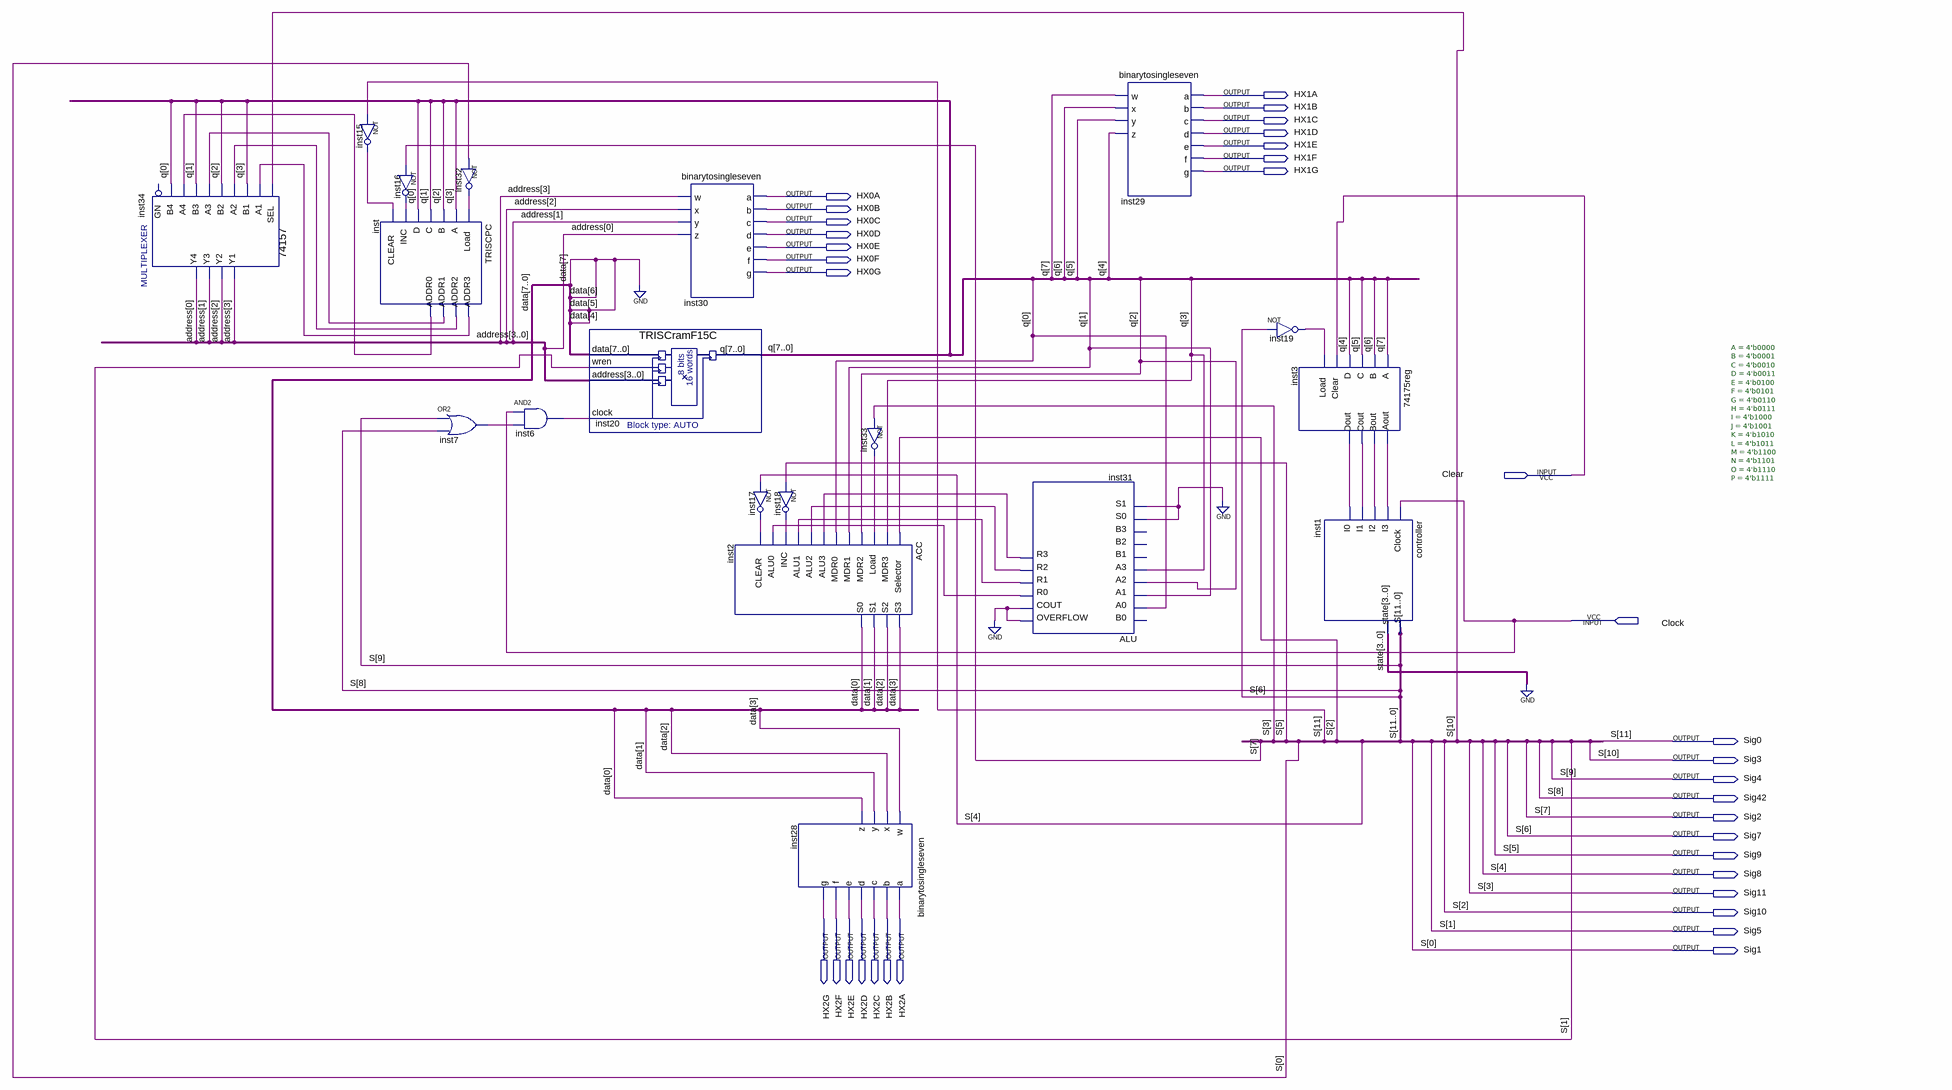
[diagram p0: schematic sheet]
// Quartus schematic TRISCC.bdf as structural Verilog: 19 symbols, 35 pins
module TRISCC (
  input  Clear,
  input  Clock,
  output HX1A,
  output HX1B,
  output HX1C,
  output HX1D,
  output HX1E,
  output HX1F,
  output HX1G,
  output HX0A,
  output HX0B,
  output HX0C,
  output HX0D,
  output HX0E,
  output HX0F,
  output HX0G,
  output Sig0,
  output Sig3,
  output Sig4,
  output Sig42,
  output Sig2,
  output Sig7,
  output Sig9,
  output Sig8,
  output Sig11,
  output Sig10,
  output HX2G,
  output HX2F,
  output HX2E,
  output HX2D,
  output HX2C,
  output HX2B,
  output HX2A,
  output Sig5,
  output Sig1
);

  wire inst3_aout, inst3_bout, inst3_cout, inst3_dout, inst6_out, inst7_out, inst15_out, inst16_out,
       inst17_out, inst18_out, inst19_out, inst31_overflow, inst31_r0, inst31_r1, inst31_r2, inst31_r3,
       inst32_out, inst33_out, inst_addr0, inst_addr1, inst_addr2, inst_addr3;
  wire [3:0] address, data, state;
  wire [7:0] q;

  \74157  inst34 (
    .A1(inst_addr3), .B1(q[3]), .SEL(Sig3), .B2(q[2]), .A3(inst_addr1), .B3(q[1]), .A2(inst_addr2),
    .B4(q[0]), .A4(inst_addr0), .Y2(address[2]), .Y1(address[3]), .Y4(address[0]), .Y3(address[1]));  // open: GN
  not inst15 (inst15_out, Sig0);
  TRISCPC inst (
    .Load(inst32_out), .A(q[3]), .B(q[2]), .C(q[1]), .D(q[0]), .INC(inst16_out), .CLEAR(inst15_out),
    .ADDR3(inst_addr3), .ADDR2(inst_addr2), .ADDR1(inst_addr1), .ADDR0(inst_addr0));
  not inst16 (inst16_out, Sig2);
  or inst7 (inst7_out, Sig4, Sig42);
  not inst32 (inst32_out, Sig1);
  and inst6 (inst6_out, Clock, inst7_out);
  TRISCramF15C inst20 (.data({4'b0000, data}), .wren(Sig5), .address(address), .clock(inst6_out), .q(q));
  binarytosingleseven inst30 (
    .w(address[3]), .x(address[2]), .y(address[1]), .z(address[0]), .a(HX0A), .b(HX0B), .c(HX0C), .d(HX0D),
    .e(HX0E), .f(HX0F), .g(HX0G));
  ACC inst2 (
    .Selector(Sig10), .MDR3(q[3]), .Load(inst33_out), .MDR2(q[2]), .MDR1(q[1]), .MDR0(q[0]),
    .ALU3(inst31_r3), .ALU2(inst31_r2), .ALU1(inst31_r1), .INC(inst18_out), .ALU0(inst31_r0),
    .CLEAR(inst17_out), .S3(data[3]), .S2(data[2]), .S1(data[1]), .S0(data[0]));
  not inst17 (inst17_out, Sig8);
  not inst18 (inst18_out, Sig9);
  binarytosingleseven inst28 (
    .w(data[3]), .x(data[2]), .y(data[1]), .z(data[0]), .a(HX2A), .b(HX2B), .c(HX2C), .d(HX2D), .e(HX2E),
    .f(HX2F), .g(HX2G));
  not inst33 (inst33_out, Sig11);
  ALU inst31 (
    .A0(q[0]), .A1(q[1]), .A2(q[2]), .A3(q[3]), .S0(1'b0), .S1(1'b0), .OVERFLOW(inst31_overflow),
    .COUT(inst31_overflow), .R0(inst31_r0), .R1(inst31_r1), .R2(inst31_r2), .R3(inst31_r3));  // open: B0, B1, B2, B3
  binarytosingleseven inst29 (
    .w(q[7]), .x(q[6]), .y(q[5]), .z(q[4]), .a(HX1A), .b(HX1B), .c(HX1C), .d(HX1D), .e(HX1E), .f(HX1F),
    .g(HX1G));
  not inst19 (inst19_out, Sig7);
  \74175reg  inst3 (
    .A(q[7]), .B(q[6]), .C(q[5]), .D(q[4]), .Clear(Clear), .Load(inst19_out), .Aout(inst3_aout),
    .Bout(inst3_bout), .Cout(inst3_cout), .Dout(inst3_dout));
  controller #(.A(4'b0000), .B(4'b0001), .C(4'b0010), .D(4'b0011), .E(4'b0100), .F(4'b0101), .G(4'b0110), .H(4'b0111), .I(4'b1000), .J(4'b1001), .K(4'b1010), .L(4'b1011), .M(4'b1100), .N(4'b1101), .O(4'b1110), .P(4'b1111)) inst1 (
    .Clock(Clock), .I3(inst3_aout), .I2(inst3_bout), .I1(inst3_cout), .I0(inst3_dout),
    .S({Sig0, Sig3, Sig4, Sig42, Sig2, Sig7, Sig9, Sig8, Sig11, Sig10, Sig5, Sig1}), .state(state));
  // also tied to GND on the sheet: {inst31_overflow, state[0], state[1], state[2], state[3]}

  // Other names for the same wires on the sheet: S[11:0] = {Sig0, Sig3, Sig4, Sig42, Sig2, Sig7, Sig9, Sig8, Sig11, Sig10, Sig5, Sig1}
endmodule
